# Altium schematic sheet MCU - Power and I_O.SchDoc: [6] MCU - Power and I/O
size A4; ApprovedBy: Nagy Richard; CheckedBy: Nagy Richard; Author: Nagy Richard; CompanyName: EmbedCore; DrawnBy: Nagy Richard; Engineer: Nagy Richard; DocumentNumber: 6; Revision: 1.0; SheetNumber: 6; SheetTotal: 15
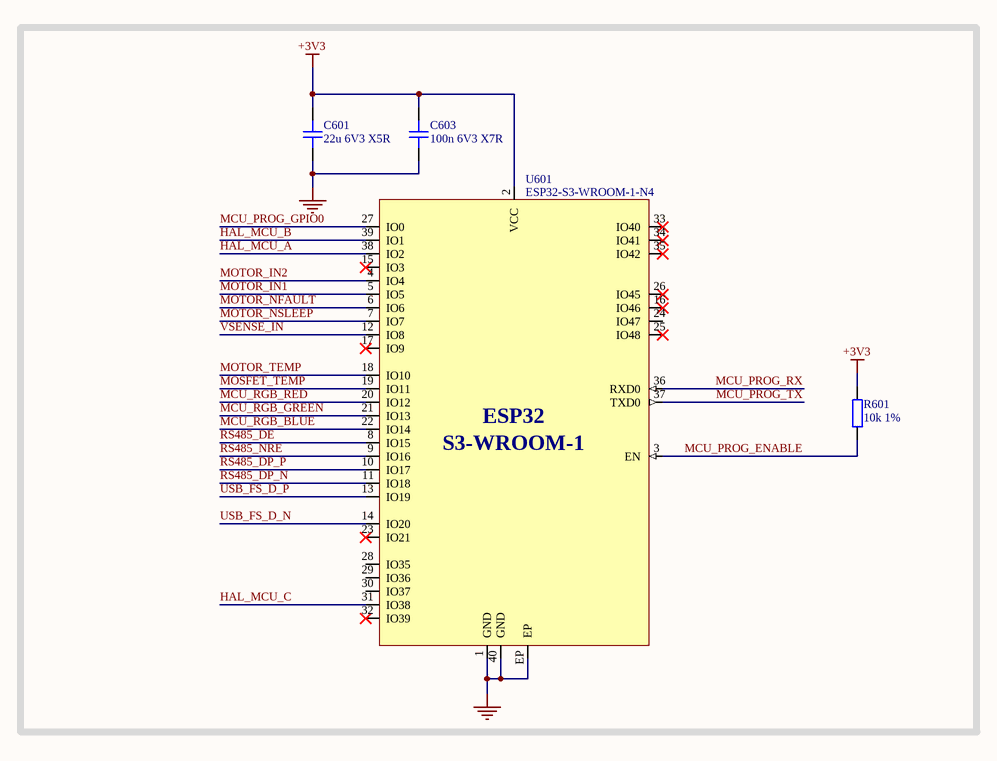
[diagram p0: MCU - Power and I_O.SchDoc]

## Parts
C601  22u 6V3 X5R  [CAP_0603]
C603  100n 6V3 X7R  [CAP_0402]
R601  10k 1%  [RES_0402]
U601  ESP32-S3-WROOM-1-N4  [ESP32-S3-WROOM-1]

## Nets
+3V3: C601.2 C603.2 R601.2 U601.2(VCC)
GND: C601.1 C603.1 U601.1(GND) U601.40(GND) U601.EP
HAL_MCU_A: U601.38(IO2)
HAL_MCU_B: U601.39(IO1)
HAL_MCU_C: U601.31(IO38)
MCU_PROG_ENABLE: R601.1 U601.3(EN)
MCU_PROG_GPIO0: U601.27(IO0)
MCU_PROG_RX: U601.36(RXD0)
MCU_PROG_TX: U601.37(TXD0)
MCU_RGB_BLUE: U601.22(IO14)
MCU_RGB_GREEN: U601.21(IO13)
MCU_RGB_RED: U601.20(IO12)
MOSFET_TEMP: U601.19(IO11)
MOTOR_IN1: U601.5(IO5)
MOTOR_IN2: U601.4(IO4)
MOTOR_NFAULT: U601.6(IO6)
MOTOR_NSLEEP: U601.7(IO7)
MOTOR_TEMP: U601.18(IO10)
RS485_DE: U601.8(IO15)
RS485_DP_N: U601.11(IO18)
RS485_DP_P: U601.10(IO17)
RS485_NRE: U601.9(IO16)
USB_FS_D_N: U601.14(IO20)
USB_FS_D_P: U601.13(IO19)
VSENSE_IN: U601.12(IO8)

Not connected (* = marked no-connect by the designer): U601 15(IO3)* 16(IO46)* 17(IO9)* 23(IO21)* 24(IO47) 25(IO48)* 26(IO45)* 28(IO35) 29(IO36) 30(IO37) 32(IO39)* 33(IO40)* 34(IO41)* 35(IO42)*

## Notes on the sheet
- Title:
- Drawn By:
- Page Contents:
- Checked By:
- Size:
- Date:
- File:
- License:
- Email:
- A4
- Number:
- Time:
- Revision:
- Sheet
- Website:
- of
- (in symbol ESP32-S3-WROOM-1-N4) ESP32; S3-WROOM-1

## Library data of the parts
C601 = CAP_0603: Capacitor SMD 0603; Manufacturer: Samsung Electro-Mechanics; Manufacturer Part Number: CL10A226MQ8NRNC; Distributor Link: www.lcsc.com; LCSC: C59461; Rating: *; Dielectric: *
C603 = CAP_0402: Capacitor SMD 0402; Manufacturer: YAGEO; Manufacturer Part Number: CC0402KRX7R5BB104; Distributor Link: www.lcsc.com; LCSC: C541406; Rating: *; Dielectric: *
R601 = RES_0402: Resistor SMD 0402; Manufacturer: PANASONIC; Manufacturer Part Number: ERJPA2F1002X; Distributor Link: www.lcsc.com; LCSC: C427247
U601 = ESP32-S3-WROOM-1-N4: 2.4 GHz Wi-Fi (802.11 b/g/n) and Bluetooth 5 (LE) Module ESP32-S3, 4MB Flash, on-board PCB antenna); Manufacturer: Espressif; Manufacturer Part Number: ESP32-S3-WROOM-1-N4; Distributor Link: https://www.mouser.de/ProductDetail/Espressif-Systems/ESP32-S3-WROOM-1-N4?qs=Li%252BoUPsLEnsO%2FkiJOUK0FQ%3D%3D